# EasyEDA schematic SCH_Type c_2022-05-16.json
TITLE: Sheet_1; REV: 1.0; Date: 2022-05-13; Sheet: 1/1; Drawn By: baggioedoardo03; Company: Your Company
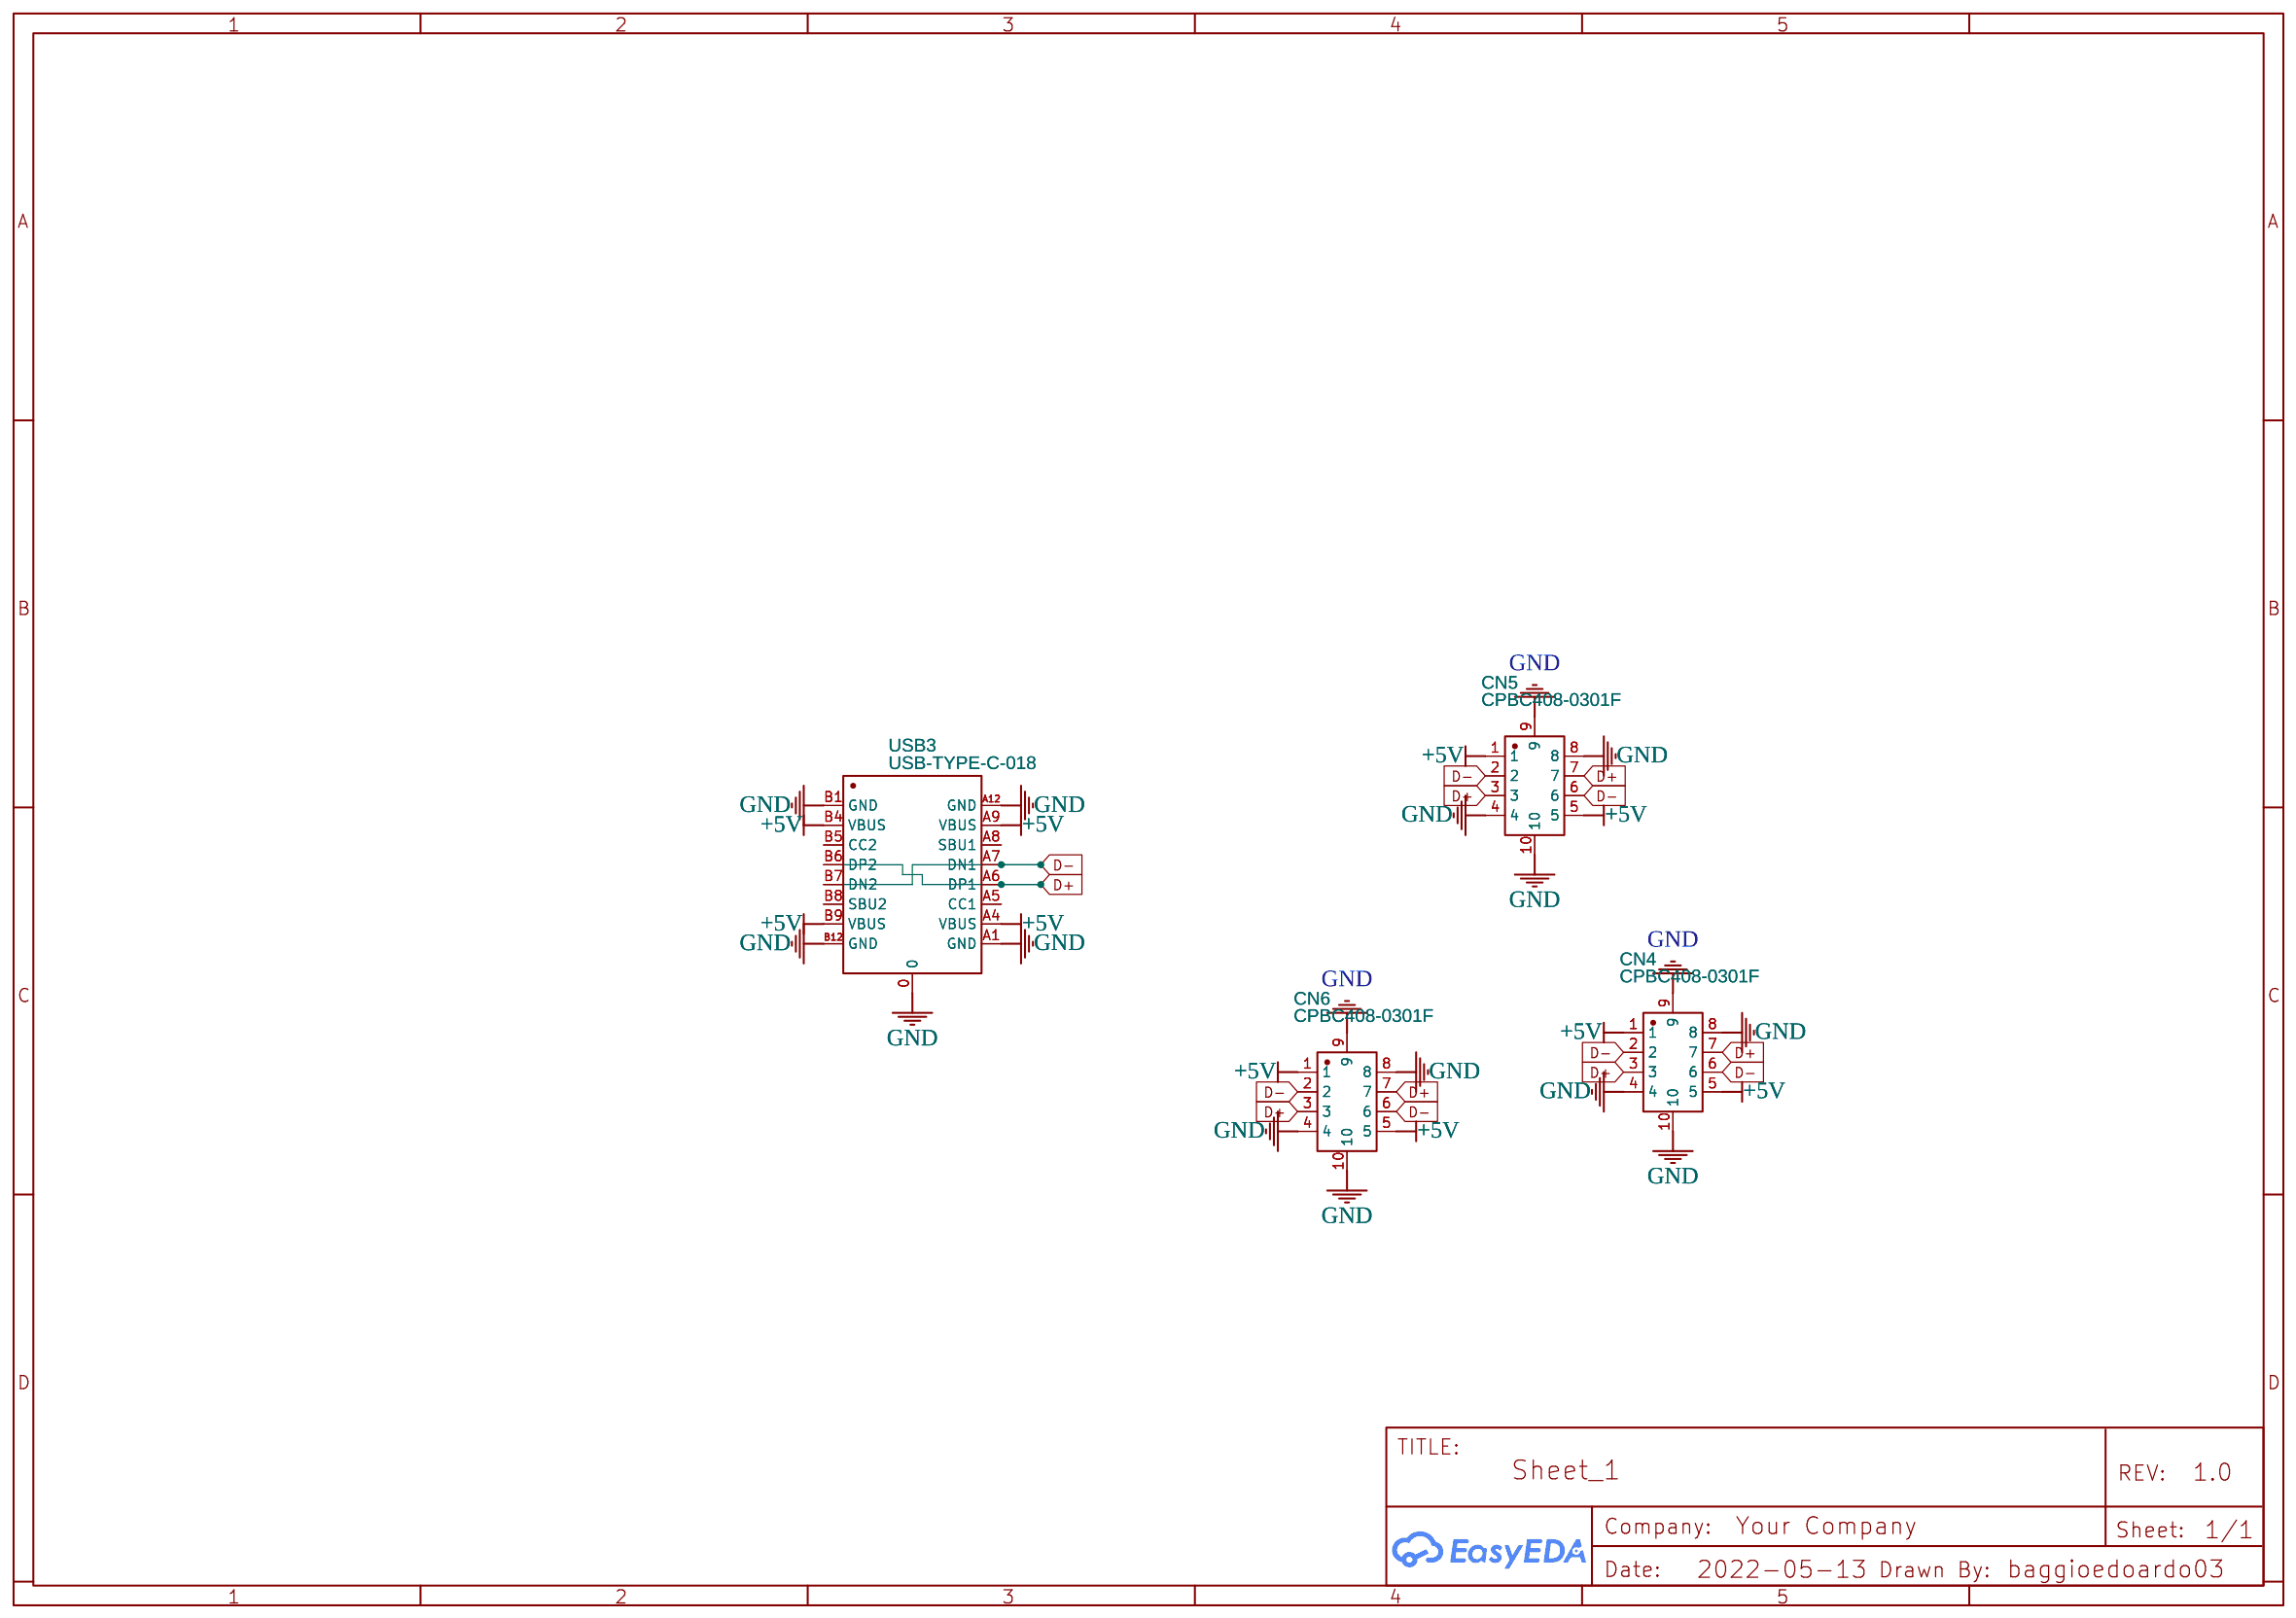
[diagram p0: schematic sheet]

## Parts
CN4  CPBC408-0301F  [CONN-SMD_CPBC408-0301F]
CN5  CPBC408-0301F  [CONN-SMD_CPBC408-0301F]
CN6  CPBC408-0301F  [CONN-SMD_CPBC408-0301F]
USB3  USB-TYPE-C-018  [USB-C_SMD-TYPE-C-31-M-12]

## Library data of the parts
CN4-CN6 = CPBC408-0301F: Supplier: LCSC; Supplier Part: C841002; Manufacturer: SMK Corp.; Contributor: LCSC; JLCPCB Part Class: Extended Part
USB3 = USB-TYPE-C-018: Supplier: LCSC; Supplier Part: C2927038; Manufacturer: DEALON(德艺隆); Contributor: LCSC; JLCPCB Part Class: Extended Part

## Nets
+5V: CN4.1 CN4.5 CN5.1 CN5.5 CN6.1 CN6.5 USB3.A4(VBUS) USB3.A9(VBUS) USB3.B4(VBUS) USB3.B9(VBUS)
GND: CN4.4 CN4.8 CN4.9 CN4.10 CN5.4 CN5.8 CN5.9 CN5.10 CN6.4 CN6.8 CN6.9 CN6.10 USB3.0 USB3.A1(GND) USB3.A12(GND) USB3.B1(GND) USB3.B12(GND)
D+: CN4.3 CN4.7 CN5.3 CN5.7 CN6.3 CN6.7 USB3.A6(DP1) USB3.B6(DP2)
D-: CN4.2 CN4.6 CN5.2 CN5.6 CN6.2 CN6.6 USB3.A7(DN1) USB3.B7(DN2)

Not connected (* = marked no-connect by the designer): USB3 A5(CC1) A8(SBU1) B5(CC2) B8(SBU2)
